# EAGLE schematic BluewalkerSchematic (EAGLE 7.2.0)
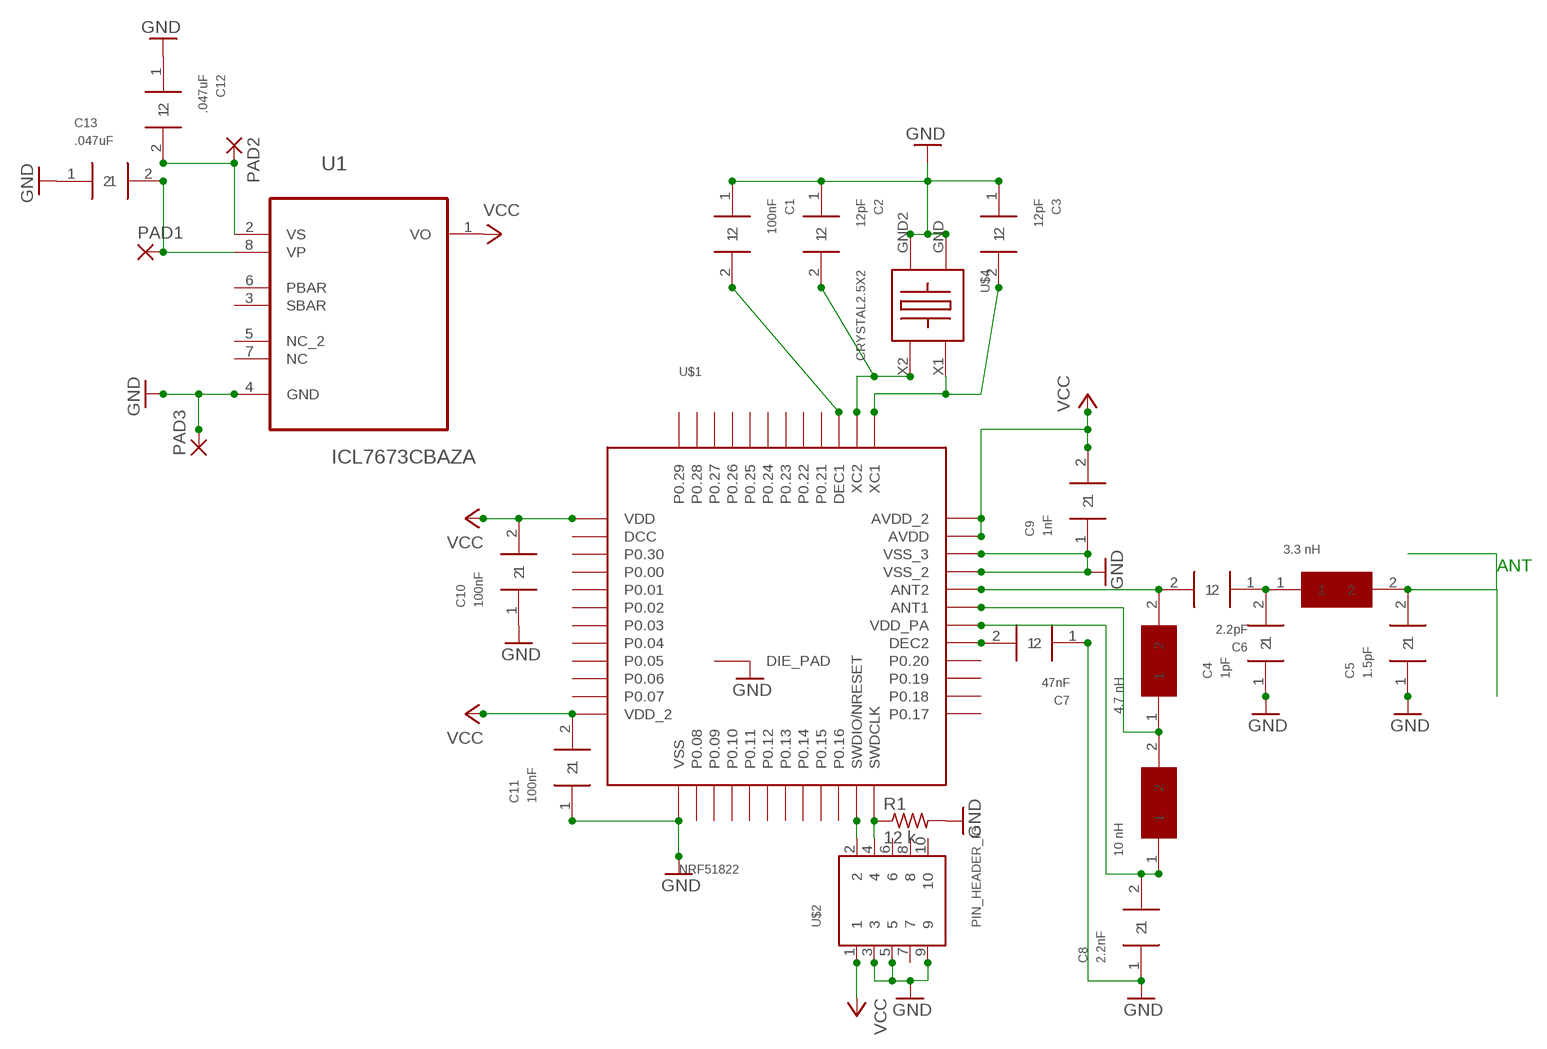
[diagram p0: schematic, sheet 1]

## Parts
C1  100nF  0402CAPACITOR  [0402CAPACITOR]
C2  12pF  0402CAPACITOR  [0402CAPACITOR]
C3  12pF  0402CAPACITOR  [0402CAPACITOR]
C4  1pF  0402CAPACITOR  [0402CAPACITOR]
C5  1.5pF  0402CAPACITOR  [0402CAPACITOR]
C6  2.2pF  0402CAPACITOR  [0402CAPACITOR]
C7  47nF  0402CAPACITOR  [0402CAPACITOR]
C8  2.2nF  0402CAPACITOR  [0402CAPACITOR]
C9  1nF  0402CAPACITOR  [0402CAPACITOR]
C10  100nF  0402CAPACITOR  [0402CAPACITOR]
C11  100nF  0402CAPACITOR  [0402CAPACITOR]
C12  .047uF  0402CAPACITOR  [0402CAPACITOR]
C13  .047uF  0402CAPACITOR  [0402CAPACITOR]
PAD1  SMD2  [SMD1,27-2,54]
PAD2  SMD2  [SMD1,27-2,54]
PAD3  SMD2  [SMD1,27-2,54]
R1  12 k  R-US_R0805  [R0805]
U1  ICL7673CBAZA  [SOIC127P600X175-8N]
U$1  NRF51822  [QFN48]
U$2  PIN_HEADER_IO  [M50-3600742]
U$3  3.3 nH  0402INDUCTOR  [0402INDUCTOR]
U$4  CRYSTAL2.5X2  [2.5X2MM]
U$5  4.7 nH  0402INDUCTOR  [0402INDUCTOR]
U$6  10 nH  0402INDUCTOR  [0402INDUCTOR]

## Nets
GND: C10.1 C12.1 C13.1
GROUND: C1.1 C2.1 C3.1 C4.1 C5.1 C7.1 C8.1 C9.1 C11.1 PAD3.1(P) R1.2 U1.4(GND) U$1.13(VSS) U$1.33(VSS_2) U$1.34(VSS_3) U$2.3 U$2.5 U$2.9 U$4.GND U$4.GND2 ; supply symbol labelled GND
N$1: C1.2 U$1.39(DEC1)
N$2: C2.2 U$1.38(XC2) U$4.X2
N$3: C3.2 U$1.37(XC1) U$4.X1
N$4: C7.2 U$1.29(DEC2)
N$5: C12.2 PAD2.1(P) U1.2(VS)
N$7: C13.2 PAD1.1(P) U1.8(VP)
N$8: C6.2 U$1.32(ANT2) U$5.2
N$9: U$1.23(SWDIO/NRESET) U$2.2
N$10: R1.1 U$1.24(SWDCLK) U$2.4
N$11: C8.2 U$1.30(VDD_PA) U$6.1
N$13: U$1.31(ANT1) U$5.1 U$6.2
N$17: C4.2 C6.1 U$3.1
N$18: C5.2 U$3.2
VCC: C9.2 C10.2 C11.2 U1.1(VO) U$1.1(VDD) U$1.12(VDD_2) U$1.35(AVDD) U$1.36(AVDD_2) U$2.1
Unconnected: U1.3(SBAR) U1.5(NC_2) U1.6(PBAR) U1.7(NC) U$1.2(DCC) U$1.3(P0.30) U$1.4(P0.00) U$1.5(P0.01) U$1.6(P0.02) U$1.7(P0.03) U$1.8(P0.04) U$1.9(P0.05) U$1.10(P0.06) U$1.11(P0.07) U$1.14(P0.08) U$1.15(P0.09) U$1.16(P0.10) U$1.17(P0.11) U$1.18(P0.12) U$1.19(P0.13) U$1.20(P0.14) U$1.21(P0.15) U$1.22(P0.16) U$1.25(P0.17) U$1.26(P0.18) U$1.27(P0.19) U$1.28(P0.20) U$1.40(P0.21) U$1.41(P0.22) U$1.42(P0.23) U$1.43(P0.24) U$1.44(P0.25) U$1.45(P0.26) U$1.46(P0.27) U$1.47(P0.28) U$1.48(P0.29) U$1.GND(DIE_PAD) U$2.6 U$2.7 U$2.8 U$2.10

## Notes on the sheet
- ANT

## Library data of the parts
C1-C13 = SKY CUSTOM STUFF:0402CAPACITOR
PAD1-PAD3 = wirepad:SMD2: SMD PAD
R1 = rcl:R-US_: RESISTOR, American symbol
U1 = Intersil_By_element14_Batch_1:ICL7673CBAZA: BACK UP SWITCH; MPN: ICL7673CBAZA; OC_FARNELL: 9663746; OC_NEWARK: 92K0566; PACKAGE: SOIC-8; SUPPLIER: Intersil
U$1 = NordicSemi:NRF51822: Bluetooth 4.0 Low Energy/2.4Ghz NORDIC SEMICONDUCTOR
U$2 = NordicSemi:PIN_HEADER_IO: Fabricante: Harwin Categoría de producto: Alojamientos de cables y cabecera Tipo de producto: Headers - Pin Strip Serie: M50-360 Paso: 1.27 mm Número de posiciones / contactos: 10 Número de filas: 2 Estilo de montaje: SMD/SMT Ángulo de montaje: Vertical Estilo de terminación: Solder Revestimiento del contacto: Gold Cantidad de empaque de fábrica: 1000
U$3 U$5 U$6 = SKY CUSTOM STUFF:0402INDUCTOR
U$4 = NordicSemi:CRYSTAL2.5X2: Crystal 16.00MHz 8pF SMD Size Dimension: 2.5mm x 2.00mm Package: 4-SMD